# Altium schematic sheet MCU.SchDoc
size A4
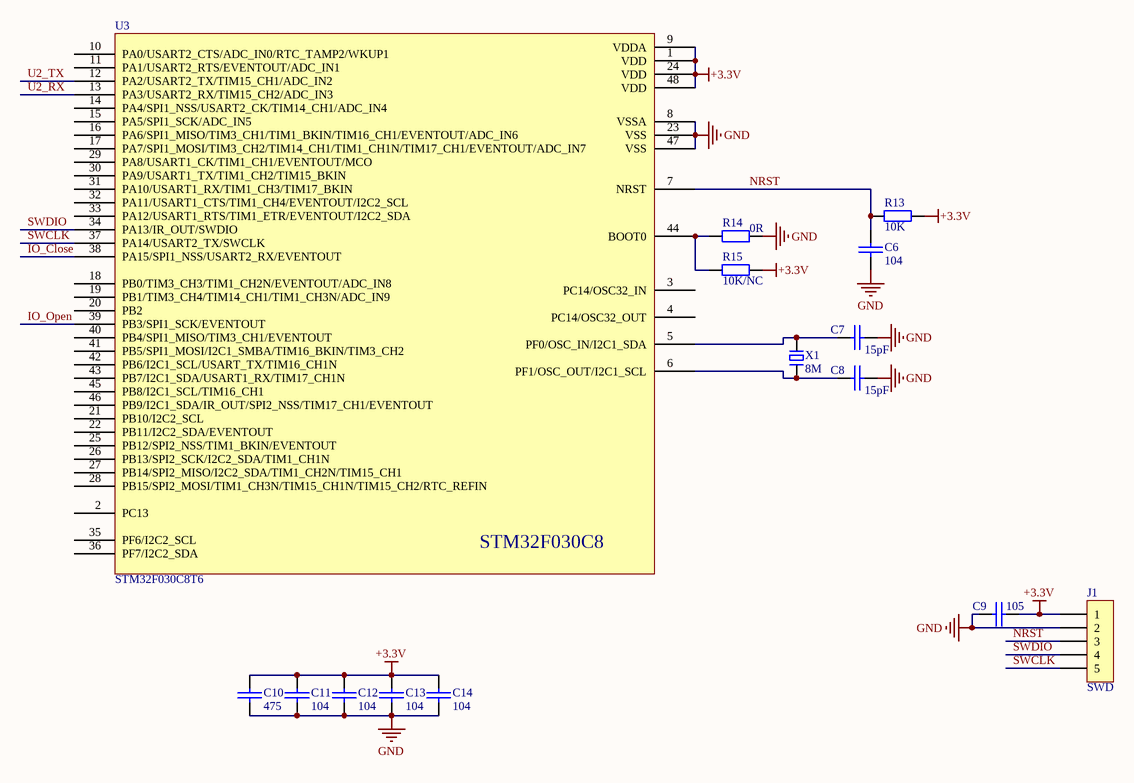
[diagram p0: MCU.SchDoc]

## Parts
C6  104  [C0805]
C7  15pF  [C0805]
C8  15pF  [C0805]
C9  105  [C0805]
C10  475  [C0805]
C11  104  [C0805]
C12  104  [C0805]
C13  104  [C0805]
C14  104  [C0805]
J1  SWD  [Fe-HDR1X5/2.54-S]
R13  10K  [R0805]
R14  0R  [R0805]
R15  10K/NC  [R0805]
U3  STM32F030C8T6  [LQFP48 7X7]
X1  8M  [OSC 5032-2P]

## Nets
+3.3V: C9.1 C10.1 C11.1 C12.1 C13.1 C14.1 J1.1 R13.2 R15.2 U3.1(VDD) U3.9(VDDA) U3.24(VDD) U3.48(VDD)
GND: C6.2 C7.1 C8.1 C9.2 C10.2 C11.2 C12.2 C13.2 C14.2 J1.2 R14.2 U3.8(VSSA) U3.23(VSS) U3.47(VSS)
IO_Close: U3.38(PA15/SPI1_NSS/USART2_RX/EVENTOUT)
IO_Open: U3.39(PB3/SPI1_SCK/EVENTOUT)
NRST: C6.1 J1.3 R13.1 U3.7(NRST)
SWCLK: J1.5 U3.37(PA14/USART2_TX/SWCLK)
SWDIO: J1.4 U3.34(PA13/IR_OUT/SWDIO)
U2_RX: U3.13(PA3/USART2_RX/TIM15_CH2/ADC_IN3)
U2_TX: U3.12(PA2/USART2_TX/TIM15_CH1/ADC_IN2)
NetC7_2: C7.2 U3.5(PF0/OSC_IN/I2C1_SDA) X1.2
NetC8_2: C8.2 U3.6(PF1/OSC_OUT/I2C1_SCL) X1.1
NetR14_1: R14.1 R15.1 U3.44(BOOT0)

Not connected (* = marked no-connect by the designer): U3 2(PC13) 3(PC14/OSC32_IN) 4(PC14/OSC32_OUT) 10(PA0/USART2_CTS/ADC_IN0/RTC_TAMP2/WKUP1) 11(PA1/USART2_RTS/EVENTOUT/ADC_IN1) 14(PA4/SPI1_NSS/USART2_CK/TIM14_CH1/ADC_IN4) 15(PA5/SPI1_SCK/ADC_IN5) 16(PA6/SPI1_MISO/TIM3_CH1/TIM1_BKIN/TIM16_CH1/EVENTOUT/ADC_IN6) 17(PA7/SPI1_MOSI/TIM3_CH2/TIM14_CH1/TIM1_CH1N/TIM17_CH1/EVENTOUT/ADC_IN7) 18(PB0/TIM3_CH3/TIM1_CH2N/EVENTOUT/ADC_IN8) 19(PB1/TIM3_CH4/TIM14_CH1/TIM1_CH3N/ADC_IN9) 20(PB2) 21(PB10/I2C2_SCL) 22(PB11/I2C2_SDA/EVENTOUT) 25(PB12/SPI2_NSS/TIM1_BKIN/EVENTOUT) 26(PB13/SPI2_SCK/I2C2_SDA/TIM1_CH1N) 27(PB14/SPI2_MISO/I2C2_SDA/TIM1_CH2N/TIM15_CH1) 28(PB15/SPI2_MOSI/TIM1_CH3N/TIM15_CH1N/TIM15_CH2/RTC_REFIN) 29(PA8/USART1_CK/TIM1_CH1/EVENTOUT/MCO) 30(PA9/USART1_TX/TIM1_CH2/TIM15_BKIN) 31(PA10/USART1_RX/TIM1_CH3/TIM17_BKIN) 32(PA11/USART1_CTS/TIM1_CH4/EVENTOUT/I2C2_SCL) 33(PA12/USART1_RTS/TIM1_ETR/EVENTOUT/I2C2_SDA) 35(PF6/I2C2_SCL) 36(PF7/I2C2_SDA) 40(PB4/SPI1_MISO/TIM3_CH1/EVENTOUT) 41(PB5/SPI1_MOSI/I2C1_SMBA/TIM16_BKIN/TIM3_CH2) 42(PB6/I2C1_SCL/USART_TX/TIM16_CH1N) 43(PB7/I2C1_SDA/USART1_RX/TIM17_CH1N) 45(PB8/I2C1_SCL/TIM16_CH1) 46(PB9/I2C1_SDA/IR_OUT/SPI2_NSS/TIM17_CH1/EVENTOUT)

## Notes on the sheet
- (in symbol STM32f030C8T6) STM32F030C8

## Library data of the parts
C6-C14 = Cap: 贴片电容or无极性电容; Value: Value
J1 = Female HDR1X5: 2.54MM排母  1x5
R13-R15 = Res: 电阻; Value: Value
X1 = XTAL-2P: 2脚无源脚晶振